# Altium schematic sheet rlink.schdoc
size 209 x 297 mm; Scale: 1:1; DocumentType: Схема электрическая принципиальная; FirstReferrence: АБВГ.123456.001; PageSetup: Record=PageOptions|CenterHorizontal=False|CenterVertical=False|PrintScale=0.95|XCorrection=0.00|YCorrection=0.00|PrintKind=1|BorderSize=5000000|LeftOffset=0|BottomOffset=0|Orientation=1|PaperLength=1000|PaperWidth=1000|Scale=100|PaperSource=15|PrintQuality=600|MediaType=1|DitherType=10|PaperKind=A4|PrintScaleMode=1
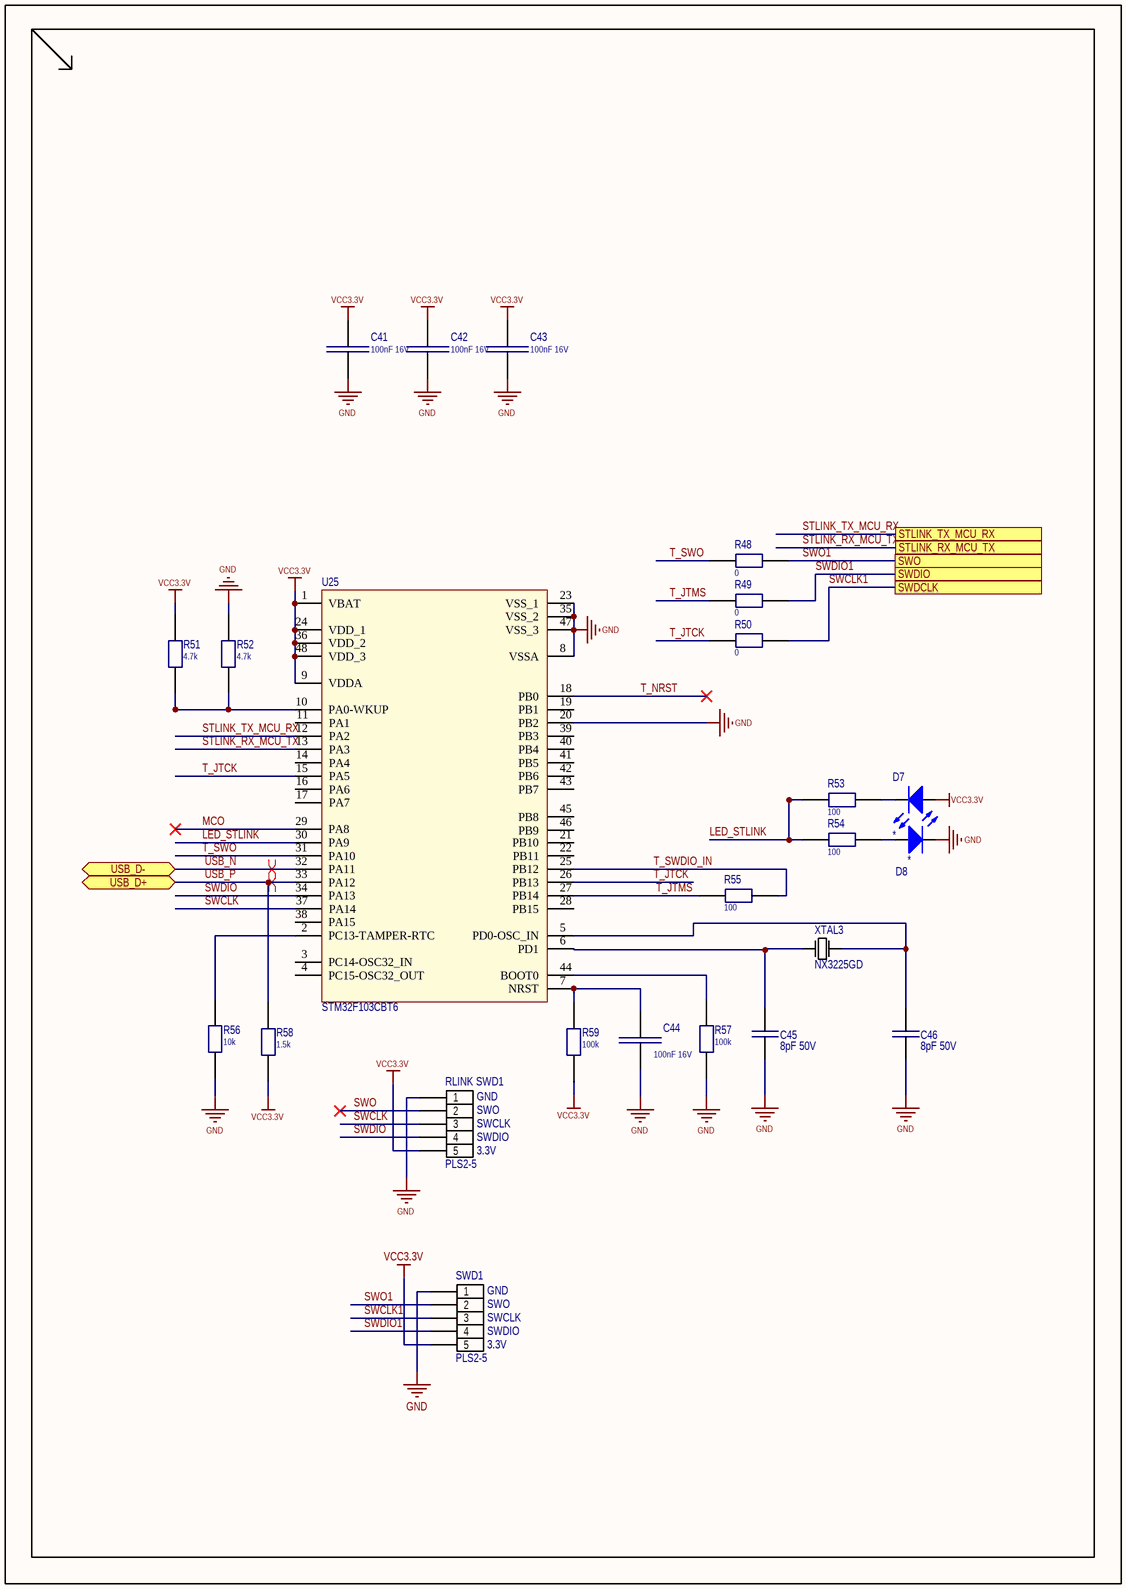
[diagram p0: rlink.schdoc]

## Parts
C41  100nF 16V  [C_0603]
C42  100nF 16V  [C_0603]
C43  100nF 16V  [C_0603]
C44  100nF 16V  [C_0603]
C45  8pF 50V  [C_0603]
C46  8pF 50V  [C_0603]
D7  *  [LED_1206]
D8  *  [LED_1206]
R48  0  [R_0603]
R49  0  [R_0603]
R50  0  [R_0603]
R51  4.7k  [R_0603]
R52  4.7k  [R_0603]
R53  100  [R_0603]
R54  100  [R_0603]
R55  100  [R_0603]
R56  10k  [R_0603]
R57  100k  [R_0603]
R58  1.5k  [R_0603]
R59  100k  [R_0603]
RLINK_SWD1  PLS2-5  [PLS-5-3D]
SWD1  PLS2-5  [PLS-5-3D]
U25  STM32F103CBT6  [LQFP48_L]
XTAL3  NX3225GD  [NX3225GD]

## Ports
STLINK_RX_MCU_TX, STLINK_TX_MCU_RX, SWDCLK, SWDIO, SWO, USB_D+ (bidir), USB_D- (bidir)

## Nets
GND: C41.1 C42.1 C43.1 C44.1 C45.1 C46.1 D8.2(K) R52.2 R56.2 R57.2 RLINK_SWD1.1 SWD1.1 U25.8(VSSA) U25.20(PB2) U25.23(VSS_1) U25.35(VSS_2) U25.47(VSS_3)
VCC3.3V: C41.2 C42.2 C43.2 D7.1(A) R51.2 R58.2 R59.2 RLINK_SWD1.5 SWD1.5 U25.1(VBAT) U25.9(VDDA) U25.24(VDD_1) U25.36(VDD_2) U25.48(VDD_3)
LED_STLINK: R53.2 R54.2 U25.30(PA9)
MCO: U25.29(PA8)
STLINK_RX_MCU_TX: U25.13(PA3) ; port STLINK_RX_MCU_TX
STLINK_TX_MCU_RX: U25.12(PA2) ; port STLINK_TX_MCU_RX
SWCLK: RLINK_SWD1.3 U25.37(PA14)
SWCLK1: R50.1 SWD1.3 ; port SWDCLK
SWDIO: RLINK_SWD1.4 U25.34(PA13)
SWDIO1: R49.1 SWD1.4 ; port SWDIO
SWO: RLINK_SWD1.2
SWO1: R48.1 SWD1.2 ; port SWO
T_JTCK: R50.2 U25.15(PA5) U25.26(PB13)
T_JTMS: R49.2 R55.2 U25.27(PB14)
T_NRST: U25.18(PB0)
T_SWDIO_IN: R55.1 U25.25(PB12)
T_SWO: R48.2 U25.31(PA10)
USB_N: U25.32(PA11) ; port USB_D-
USB_P: R58.1 U25.33(PA12) ; port USB_D+
NetC44_2: C44.2 R59.1 U25.7(NRST)
NetC45_2: C45.2 U25.6(PD1) XTAL3.2(OSC2)
NetC46_2: C46.2 U25.5(PD0-OSC_IN) XTAL3.1(OSC1)
NetD7_2: D7.2(K) R53.1
NetD8_1: D8.1(A) R54.1
NetR51_1: R51.1 R52.1 U25.10(PA0-WKUP)
NetR56_1: R56.1 U25.2(PC13-TAMPER-RTC)
NetR57_1: R57.1 U25.44(BOOT0)

Not connected (* = marked no-connect by the designer): U25 3(PC14-OSC32_IN) 4(PC15-OSC32_OUT) 11(PA1) 14(PA4) 16(PA6) 17(PA7) 19(PB1) 21(PB10) 22(PB11) 28(PB15) 38(PA15) 39(PB3) 40(PB4) 41(PB5) 42(PB6) 43(PB7) 45(PB8) 46(PB9)

## Layout directives
differential pair: USB_N, USB_P

## Notes on the sheet
- (in symbol PLS2-5) GND; SWO; SWCLK; SWDIO; 3.3V

## Library data of the parts
C41-C44 = C0603: Capacitor; Part Number: CC0603KPX7R9BB104; Value: 100nF 16V
C45 C46 = CAP_SMD: Capacitor; Part Number: CC0603DRNPO9BN8R0; Alternative Part: *; Value: 8pF 50V
D7 D8 = LED_SMT_1206: Typical INFRARED GaAs LED; Part Number: KP-3216SGD; Value: *; Color: *
R48-R50 = RES_SMD: Resistor; Part Number: RC0603FR-070RL; Alternative Part: *; Value: 0
R51 R52 = RES_SMD: Resistor; Part Number: RC0603FR-074K7L; Alternative Part: *; Value: 4.7k
R53-R55 = RES_SMD: Resistor; Part Number: RC0603JR-07100RL; Alternative Part: *; Value: 100
R56 = RES_SMD: Resistor; Part Number: RC0603FR-0710KL; Alternative Part: *; Value: 10k
R57 R59 = RES_SMD: Resistor; Part Number: RC0603FR-07100KL; Alternative Part: *; Value: 100k
R58 = RES_SMD: Resistor; Part Number: RC0603FR-071K5L; Alternative Part: *; Value: 1.5k
RLINK_SWD1 SWD1 = PLS2-5: Header, 5-Pin; Part Number: PLS-5; LatestRevisionDate: 17-Jul-2002; LatestRevisionNote: Re-released for DXP Platform.; Publisher: Altium Limited
U25 = STM32F103C8T6(1): Part Number: STM32F103CBT6; Alternative Part: *
XTAL3 = NX3225GD: Crystal Oscillator; Part Number: NX3225GD-8MHZ-EXS00A-CG05041; Alternative Part: *